# Altium project USB Hub Breakout.PrjPcb
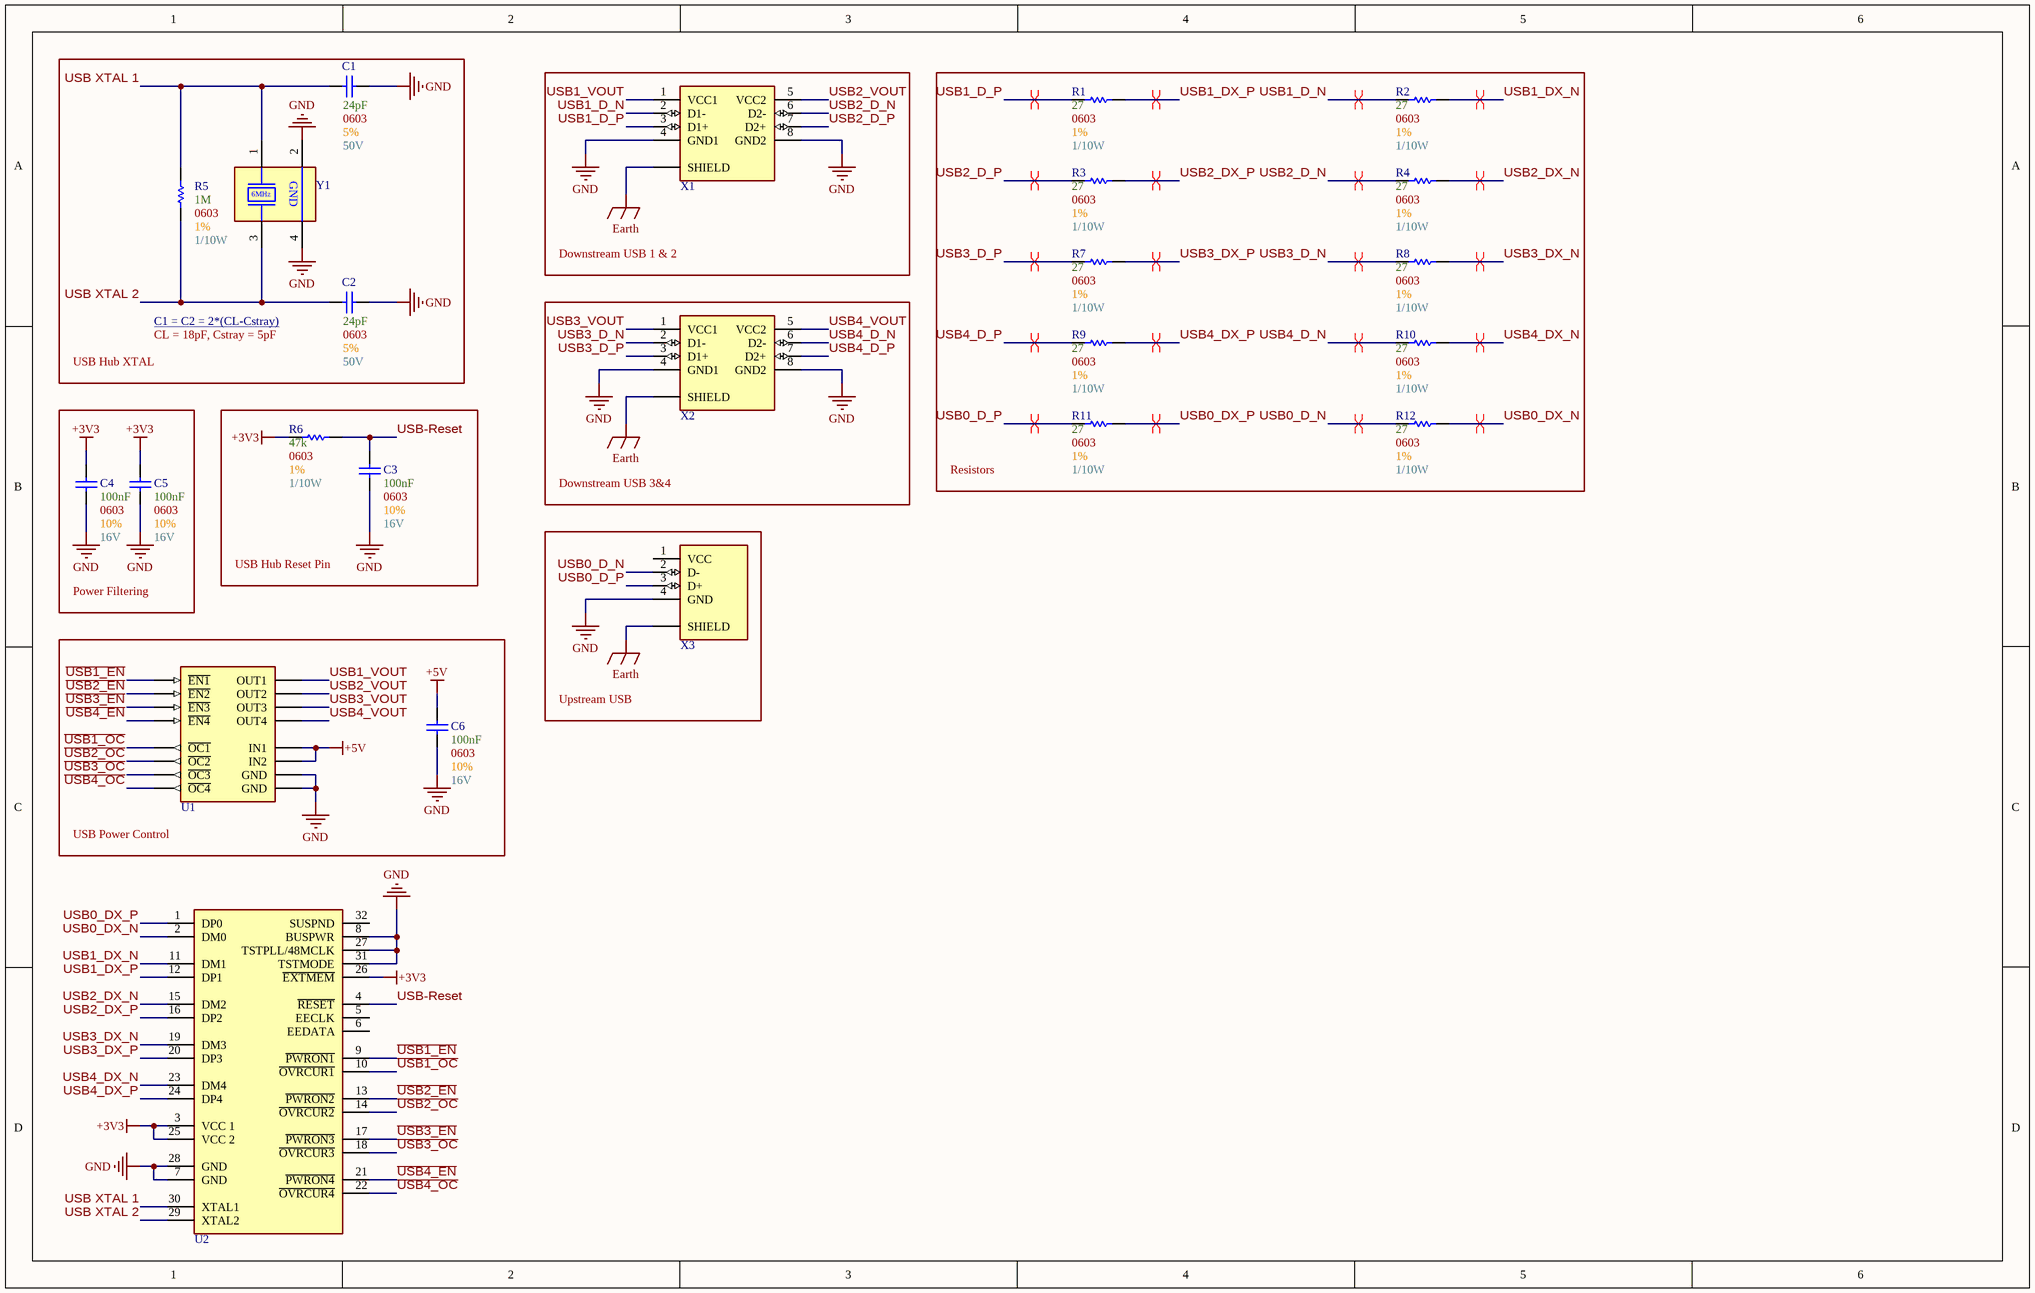
[diagram p0: USB Hub.SchDoc]
2 sheets, 35 parts. Net scope: global (net labels, ports and power ports of the same name join across sheets).
Board file: Main.PcbDoc
Sheets:
  USB Hub.SchDoc
  Regulator.SchDoc

## Sheet USB Hub.SchDoc
size B; SheetNumber: 1; SheetTotal: 2

### Parts
C1  Max Voltage: 50V  Size Package: 0603  Tolerance: 5%  Capacitance: 24pF  [[Cap] SMD 0603]  (hidden comment: [Cap] 0603 24pF 1% 100V)
C2  Max Voltage: 50V  Size Package: 0603  Tolerance: 5%  Capacitance: 24pF  [[Cap] SMD 0603]  (hidden comment: [Cap] 0603 24pF 1% 100V)
C3  Max Voltage: 16V  Size Package: 0603  Tolerance: 10%  Capacitance: 100nF  [[Cap] SMD 0603]  (hidden comment: [Cap] 0603 0.1uF 10% 16V)
C4  Max Voltage: 16V  Size Package: 0603  Tolerance: 10%  Capacitance: 100nF  [[Cap] SMD 0603]  (hidden comment: [Cap] 0603 0.1uF 10% 16V)
C5  Max Voltage: 16V  Size Package: 0603  Tolerance: 10%  Capacitance: 100nF  [[Cap] SMD 0603]  (hidden comment: [Cap] 0603 0.1uF 10% 16V)
C6  Max Voltage: 16V  Size Package: 0603  Tolerance: 10%  Capacitance: 100nF  [[Cap] SMD 0603]  (hidden comment: [Cap] 0603 0.1uF 10% 16V)
R1  Wattage: 1/10W  Tolerance: 1%  Resistance: 27  Size Package: 0603  [[Res] SMD 0603]  (hidden comment: [27] SMD 0603 1% 1/10W)
R2  Wattage: 1/10W  Tolerance: 1%  Resistance: 27  Size Package: 0603  [[Res] SMD 0603]  (hidden comment: [27] SMD 0603 1% 1/10W)
R3  Wattage: 1/10W  Tolerance: 1%  Resistance: 27  Size Package: 0603  [[Res] SMD 0603]  (hidden comment: [27] SMD 0603 1% 1/10W)
R4  Wattage: 1/10W  Tolerance: 1%  Resistance: 27  Size Package: 0603  [[Res] SMD 0603]  (hidden comment: [27] SMD 0603 1% 1/10W)
R5  Wattage: 1/10W  Tolerance: 1%  Resistance: 1M  Size Package: 0603  [[Res] SMD 0603]  (hidden comment: [1M] SMD 0603 1% 1/10W)
R6  Wattage: 1/10W  Tolerance: 1%  Resistance: 47k  Size Package: 0603  [[Res] SMD 0603]  (hidden comment: [47k] SMD 0603 1% 1/10W)
R7  Wattage: 1/10W  Tolerance: 1%  Resistance: 27  Size Package: 0603  [[Res] SMD 0603]  (hidden comment: [27] SMD 0603 1% 1/10W)
R8  Wattage: 1/10W  Tolerance: 1%  Resistance: 27  Size Package: 0603  [[Res] SMD 0603]  (hidden comment: [27] SMD 0603 1% 1/10W)
R9  Wattage: 1/10W  Tolerance: 1%  Resistance: 27  Size Package: 0603  [[Res] SMD 0603]  (hidden comment: [27] SMD 0603 1% 1/10W)
R10  Wattage: 1/10W  Tolerance: 1%  Resistance: 27  Size Package: 0603  [[Res] SMD 0603]  (hidden comment: [27] SMD 0603 1% 1/10W)
R11  Wattage: 1/10W  Tolerance: 1%  Resistance: 27  Size Package: 0603  [[Res] SMD 0603]  (hidden comment: [27] SMD 0603 1% 1/10W)
R12  Wattage: 1/10W  Tolerance: 1%  Resistance: 27  Size Package: 0603  [[Res] SMD 0603]  (hidden comment: [27] SMD 0603 1% 1/10W)
U1  [USB Power] 500mA 4port  [[IC] USB Hub Power Distribution]  (value not drawn)
U2  4port  [[USB Hub] USB2.0 4port]  (value not drawn)
X1  USB-A  [[USB] Type-A Dual]  (value not drawn)
X2  USB-A  [[USB] Type-A Dual]  (value not drawn)
X3  USB-A  [[USB] Type-A]  (value not drawn)
Y1  [Crystal] SMD 6MHz  [[Crystal] SMD 6MHz]  (value not drawn)

### Blocks framed on the sheet
Downstream USB 1 & 2: X1
Resistors: R1-R4 R7-R12
Downstream USB 3&4: X2
Power Filtering: C4 C5
USB Hub Reset Pin: C3 R6
Upstream USB: X3
USB Power Control: C6 U1

### Nets
+3V3: C4.2 C5.2 R6.1 U2.3(VCC_1) U2.25(VCC_2) U2.26(~{EXTMEM})
+5V: C6.2 U1.2(IN1) U1.6(IN2)
Earth: X1.MH(SHIELD) X2.MH(SHIELD) X3.MH(SHIELD)
GND: C1.2 C2.2 C3.1 C4.1 C5.1 C6.1 U1.1(GND) U1.5(GND) U2.7(GND) U2.8(BUSPWR) U2.27(TSTPLL/48MCLK) U2.28(GND) U2.31(TSTMODE) X1.4(GND1) X1.8(GND2) X2.4(GND1) X2.8(GND2) X3.4(GND) Y1.2(GND) Y1.4(GND)
~{USB1_EN}: U1.3(~{EN1}) U2.9(~{PWRON1})
~{USB1_OC}: U1.16(~{OC1}) U2.10(~{OVRCUR1})
~{USB2_EN}: U1.4(~{EN2}) U2.13(~{PWRON2})
~{USB2_OC}: U1.13(~{OC2}) U2.14(~{OVRCUR2})
~{USB3_EN}: U1.7(~{EN3}) U2.17(~{PWRON3})
~{USB3_OC}: U1.12(~{OC3}) U2.18(~{OVRCUR3})
~{USB4_EN}: U1.8(~{EN4}) U2.21(~{PWRON4})
~{USB4_OC}: U1.9(~{OC4}) U2.22(~{OVRCUR4})
USB0_D_N: R12.1 X3.2(D-)
USB0_D_P: R11.1 X3.3(D+)
USB0_DX_N: R12.2 U2.2(DM0)
USB0_DX_P: R11.2 U2.1(DP0)
USB1_D_N: R2.1 X1.2(D1-)
USB1_D_P: R1.1 X1.3(D1+)
USB1_DX_N: R2.2 U2.11(DM1)
USB1_DX_P: R1.2 U2.12(DP1)
USB1_VOUT: U1.15(OUT1) X1.1(VCC1)
USB2_D_N: R4.1 X1.6(D2-)
USB2_D_P: R3.1 X1.7(D2+)
USB2_DX_N: R4.2 U2.15(DM2)
USB2_DX_P: R3.2 U2.16(DP2)
USB2_VOUT: U1.14(OUT2) X1.5(VCC2)
USB3_D_N: R8.1 X2.2(D1-)
USB3_D_P: R7.1 X2.3(D1+)
USB3_DX_N: R8.2 U2.19(DM3)
USB3_DX_P: R7.2 U2.20(DP3)
USB3_VOUT: U1.11(OUT3) X2.1(VCC1)
USB4_D_N: R10.1 X2.6(D2-)
USB4_D_P: R9.1 X2.7(D2+)
USB4_DX_N: R10.2 U2.23(DM4)
USB4_DX_P: R9.2 U2.24(DP4)
USB4_VOUT: U1.10(OUT4) X2.5(VCC2)
USB XTAL 1: C1.1 R5.2 U2.30(XTAL1) Y1.1(XTAL1)
USB XTAL 2: C2.1 R5.1 U2.29(XTAL2) Y1.3(XTAL2)
USB-Reset: C3.2 R6.2 U2.4(~{RESET})

Not connected (* = marked no-connect by the designer): U2 5(EECLK) 6(EEDATA) 32(SUSPND); X3 1(VCC)

### Layout directives
differential pair; differential pair class USB_Pairs: USB0_D_N, USB0_D_P, USB0_DX_N, USB0_DX_P, USB1_D_N, USB1_D_P, USB1_DX_N, USB1_DX_P, USB2_D_N, USB2_D_P, USB2_DX_N, USB2_DX_P, USB3_D_N, USB3_D_P, USB3_DX_N, USB3_DX_P, USB4_D_N, USB4_D_P, USB4_DX_N, USB4_DX_P

### Notes on the sheet
- USB Hub XTAL
- (near C2) C1 = C2 = 2*(CL-Cstray) <https://microchip.my.site.com/s/article/Calculating-crystal-load-capacitor>
- CL = 18pF, Cstray = 5pF
- (in symbol [Crystal] SMD 6MHz) 6MHz

### Library data of the parts
C1 C2 = [Cap] 0603 24pF 1% 100V: CC0603JRNPO9BN240; Supplier 1: DigiKey; Supplier Part Number 1: 311-1772-1-ND
C3-C6 = [Cap] 0603 0.1uF 10% 16V: CC0603KRX7R7BB104; Supplier 1: DigiKey; Supplier Part Number 1: 311-1088-6-ND
R1-R4 R7-R12 = [27] SMD 0603 1% 1/10W: MCT06030C2709FP500; Supplier 1: DigiKey; Supplier Part Number 1: 749-1631-1-ND
R5 = [1M] SMD 0603 1% 1/10W: RC0603FR-071ML; Supplier 1: DigiKey; Supplier Part Number 1: 311-1.00MHRDKR-ND
R6 = [47k] SMD 0603 1% 1/10W: RC0603FR-0747KL; Supplier 1: DigiKey; Supplier Part Number 1: 311-47.0KHRDKR-ND
U1 = [USB Power] 500mA 4port: TPS2044BDR; Supplier 1: DigiKey; Supplier Part Number 1: 296-26909-6-ND
U2 = [USB Hub] USB 2.0 4port: TUSB2046BVFR; Supplier 1: DigiKey; Supplier Part Number 1: 296-27131-1-ND
X1 X2 = [USB] Type-A Dual: 61400826021; Supplier 1: DigiKey; Supplier Part Number 1: 732-2107-ND
X3 = [USB] Type-A: KUSBEX-ASFS1N-B; Supplier 1: DigiKey; Supplier Part Number 1: 2092-KUSBEX-ASFS1N-B-ND
Y1 = [Crystal] SMD 6MHz: ECS-060-18-20BM-JEN-TR; Supplier 1: DigiKey; Supplier Part Number 1: XC2349DKR-ND

## Sheet Regulator.SchDoc
size A; SheetNumber: 2; SheetTotal: 2
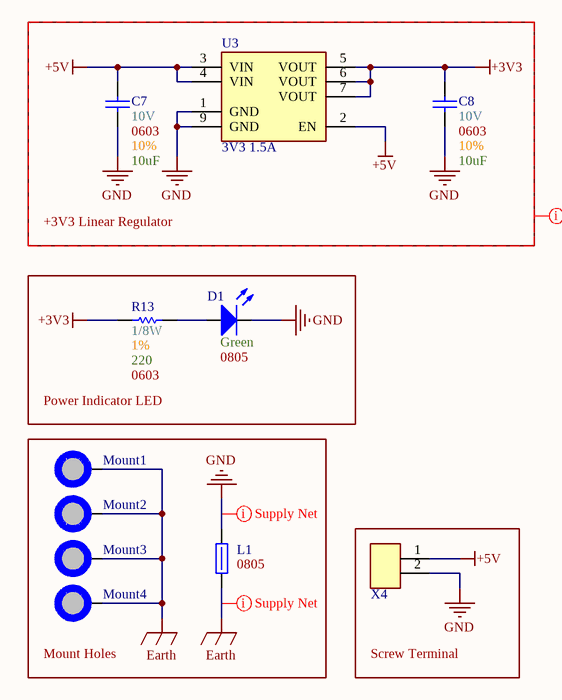
[diagram p1: Regulator.SchDoc]

### Parts
C7  Max Voltage: 10V  Size Package: 0603  Tolerance: 10%  Capacitance: 10uF  [[Cap] SMD 0603]  (hidden comment: [Cap] 0603 10uF 10% 10V)
C8  Max Voltage: 10V  Size Package: 0603  Tolerance: 10%  Capacitance: 10uF  [[Cap] SMD 0603]  (hidden comment: [Cap] 0603 10uF 10% 10V)
D1  Color: Green  Size Package: 0805  [[LED] SMD 0805]  (hidden comment: [LED] SMD 0805 Green)
L1  Size Package: 0805  [[Ferrite] SMD 0805]  (hidden comment: 652-MH2029-300Y)
Mount1  M3 Mount Hole  [[Mount] M3 Mount Hole]  (value not drawn)  (no BOM)
Mount2  M3 Mount Hole  [[Mount] M3 Mount Hole]  (value not drawn)  (no BOM)
Mount3  M3 Mount Hole  [[Mount] M3 Mount Hole]  (value not drawn)  (no BOM)
Mount4  M3 Mount Hole  [[Mount] M3 Mount Hole]  (value not drawn)  (no BOM)
R13  Wattage: 1/8W  Tolerance: 1%  Resistance: 220  Size Package: 0603  [[Res] SMD 0603]  (hidden comment: [220] SMD 0603 1% 1/10W)
U3  3V3 1.5A  [[Linear] 3V3 1.5A]
X4  2pin Screw Terminal  [[Screw Terminal] 2pin 5mm]  (value not drawn)

### Blocks framed on the sheet
+3V3 Linear Regulator: C7 C8 U3
Power Indicator LED: D1 R13
Mount Holes: L1 Mount1-Mount4
Screw Terminal: X4

### Nets
+3V3: C8.2 R13.1 U3.5(VOUT) U3.6(VOUT) U3.7(VOUT)
+5V: C7.2 U3.2(EN) U3.3(VIN) U3.4(VIN) X4.1
Earth: L1.1 Mount1.1 Mount2.1 Mount3.1 Mount4.1
GND: C7.1 C8.1 D1.2(Cathode) L1.2 U3.1(GND) U3.9(GND) X4.2
NetD1_1: D1.1(Anode) R13.2

### Layout directives
net class Supply_Nets: +3V3, +5V, Earth, GND

### Library data of the parts
C7 C8 = [Cap] 0603 10uF 10% 10V: CL10A106KP8NNNC; Supplier 1: DigiKey; Supplier Part Number 1: 1276-1192-6-ND
D1 = [LED] SMD 0805 Green: LG R971-KN-1-0-20-R18; Supplier 1: DigiKey; Supplier Part Number 1: 475-LGR971-KN-1CT-ND
L1 = [Ferrite] SMD 0805 3A 30ohm: Res @ Freq: 30 @ 100MHz; Supplier 1: DigiKey; Supplier Part Number 1: MH2029-300YCT-ND
Mount1-Mount4 = [Mount] M3 Mount Hole: Place at least 4.5mm from board edge. Plated.
R13 = [220] SMD 0603 1% 1/10W: CRGCQ0805F220R; Supplier 1: DigiKey; Supplier Part Number 1: A129741CT-ND
U3 = [Linear] 3V3 1.5A: AP7362A-33SP-13; Supplier 1: DigiKey; Supplier Part Number 1: AP7362A-33SP-13DICT-ND
X4 = [Screw Terminal] 2pin: TB002-500-02BE; Supplier 1: DigiKey; Supplier Part Number 1: 102-6145-ND

## Nets that join several sheets
+3V3: USB Hub (6 pins), Regulator (5 pins)
+5V: USB Hub (C6.2 U1.2 U1.6), Regulator (5 pins)
Earth: USB Hub (X1.MH X2.MH X3.MH), Regulator (5 pins)
GND: USB Hub (20 pins), Regulator (7 pins)